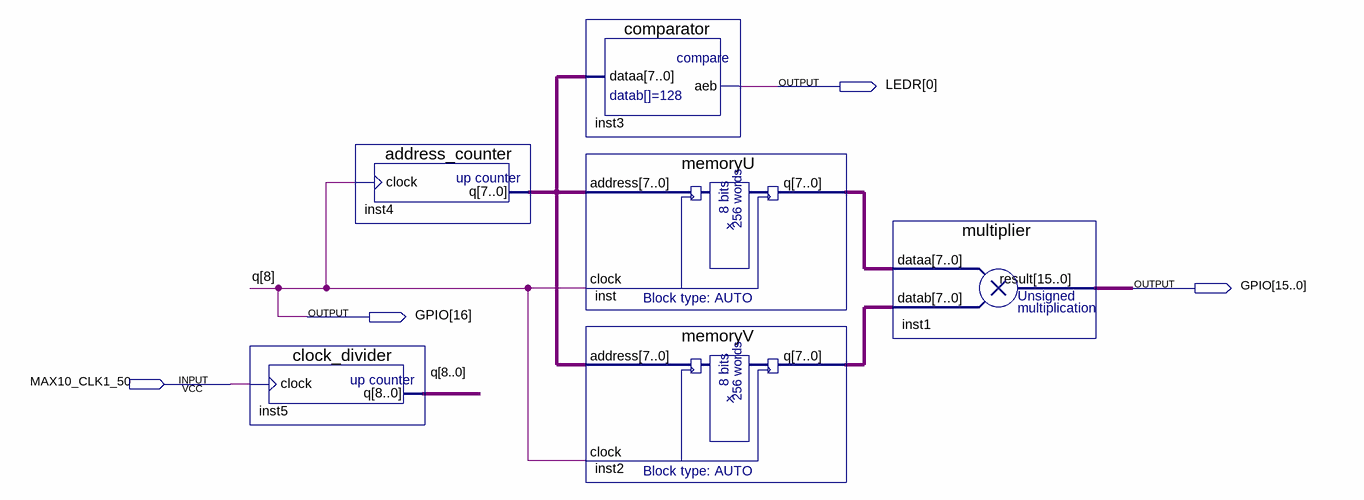
[diagram p0: schematic sheet]
// Quartus schematic vector_multiplier_fpga.bdf as structural Verilog: 6 symbols, 4 pins
module vector_multiplier_fpga (
  input  MAX10_CLK1_50,
  output [0:0] LEDR,
  output [16:0] GPIO
);

  wire [7:0] inst2_q, inst4_q, inst_q, q;

  clock_divider inst5 (.clock(MAX10_CLK1_50), .q({GPIO[16], q}));
  address_counter inst4 (.clock(GPIO[16]), .q(inst4_q));
  comparator inst3 (.dataa(inst4_q), .aeb(LEDR[0]));
  memoryU inst (.address(inst4_q), .clock(GPIO[16]), .q(inst_q));
  memoryV inst2 (.address(inst4_q), .clock(GPIO[16]), .q(inst2_q));
  multiplier inst1 (.dataa(inst_q), .datab(inst2_q), .result(GPIO[15:0]));

  // Other names for the same wires on the sheet: q[8] = GPIO[16]
endmodule
